# EAGLE design hvreg_feedback (EAGLE 7.2.0)
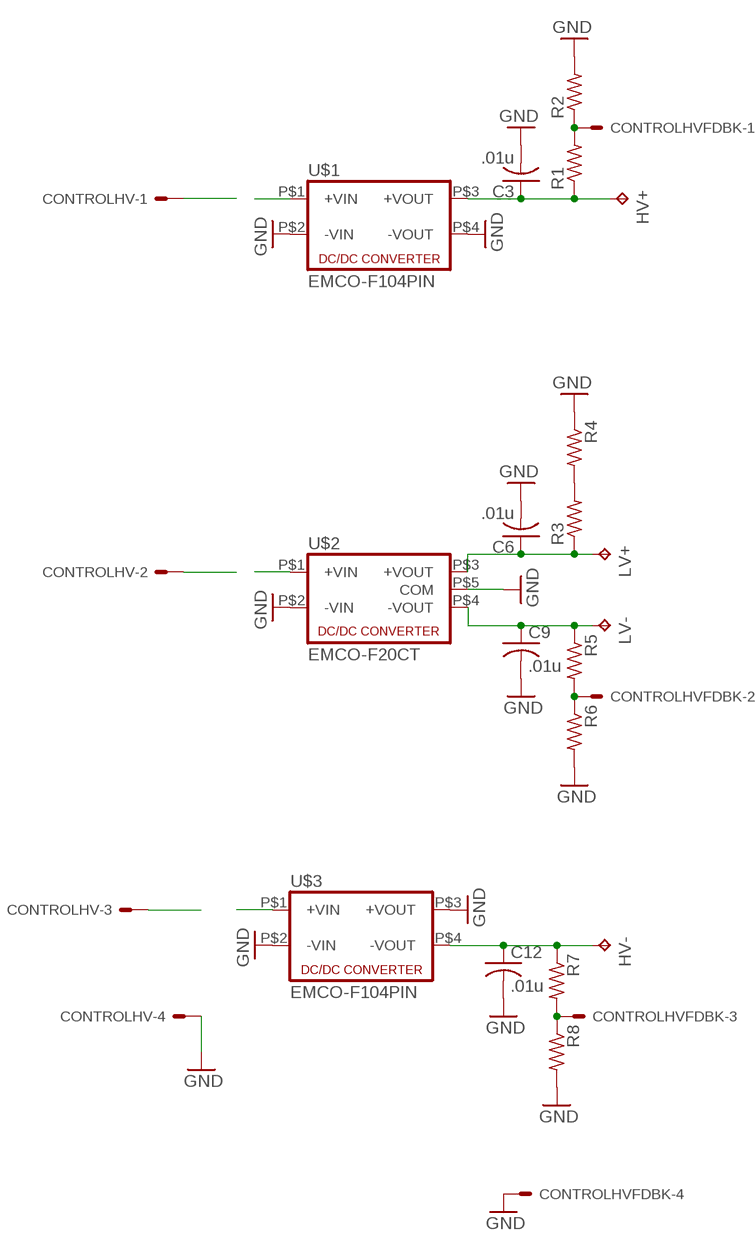
[diagram p0: schematic, sheet 1]

## Parts
C3  .01u  C-US075-042X103  [C075-042X103]
C6  .01u  C-US075-042X103  [C075-042X103]
C9  .01u  C-US075-042X103  [C075-042X103]
C12  .01u  C-US075-042X103  [C075-042X103]
CONTROLHV  KK-156-4  [KK-156-4]
CONTROLHVFDBK  KK-156-4  [KK-156-4]
HV+  TPPAD1-20Y  [P1-20Y]
HV-  TPPAD1-20Y  [P1-20Y]
LV+  TPPAD1-20Y  [P1-20Y]
LV-  TPPAD1-20Y  [P1-20Y]
R1  R-US_0207/12  [0207/12]
R2  R-US_0207/12  [0207/12]
R3  R-US_0207/12  [0207/12]
R4  R-US_0207/12  [0207/12]
R5  R-US_0207/12  [0207/12]
R6  R-US_0207/12  [0207/12]
R7  R-US_0207/12  [0207/12]
R8  R-US_0207/12  [0207/12]
U$1  EMCO-F104PIN  [EMCO-F]
U$2  EMCO-F20CT  [EMCO-F*CT]
U$3  EMCO-F104PIN  [EMCO-F]

## Nets
GND: C3.2 C6.2 C9.2 C12.2 CONTROLHV.4 CONTROLHVFDBK.4 R2.2 R4.1 R6.2 R8.2 U$1.P$2(-VIN) U$1.P$4(-VOUT) U$2.P$2(-VIN) U$2.P$5(COM) U$3.P$2(-VIN) U$3.P$3(+VOUT)
N$1: C3.1 HV+.TP R1.1 U$1.P$3(+VOUT)
N$2: C12.1 HV-.TP R7.1 U$3.P$4(-VOUT)
N$3: CONTROLHVFDBK.1 R1.2 R2.1
N$4: R3.2 R4.2
N$5: C6.1 LV+.TP R3.1 U$2.P$3(+VOUT)
N$6: C9.1 LV-.TP R5.1 U$2.P$4(-VOUT)
N$7: CONTROLHVFDBK.2 R5.2 R6.1
N$8: CONTROLHVFDBK.3 R7.2 R8.1
VREG1: CONTROLHV.1 U$1.P$1(+VIN)
VREG2: CONTROLHV.2 U$2.P$1(+VIN)
VREG3: CONTROLHV.3 U$3.P$1(+VIN)

## Library data of the parts
C3 C6 C9 C12 = rcl:C-US: CAPACITOR, American symbol
CONTROLHV CONTROLHVFDBK = con-molex:KK-156-4: KK 156 HEADER Source: http://www.molex.com/pdm_docs/sd/026604100_sd.pdf; OC_FARNELL: unknown; OC_NEWARK: unknown
HV+ HV- LV+ LV- = testpad:TP: Test pad
R1-R8 = resistor:R-US_: RESISTOR, American symbol
U$1 U$3 = dc-dc-converter:EMCO-F10
U$2 = dc-dc-converter:EMCO-F20CT

## Board
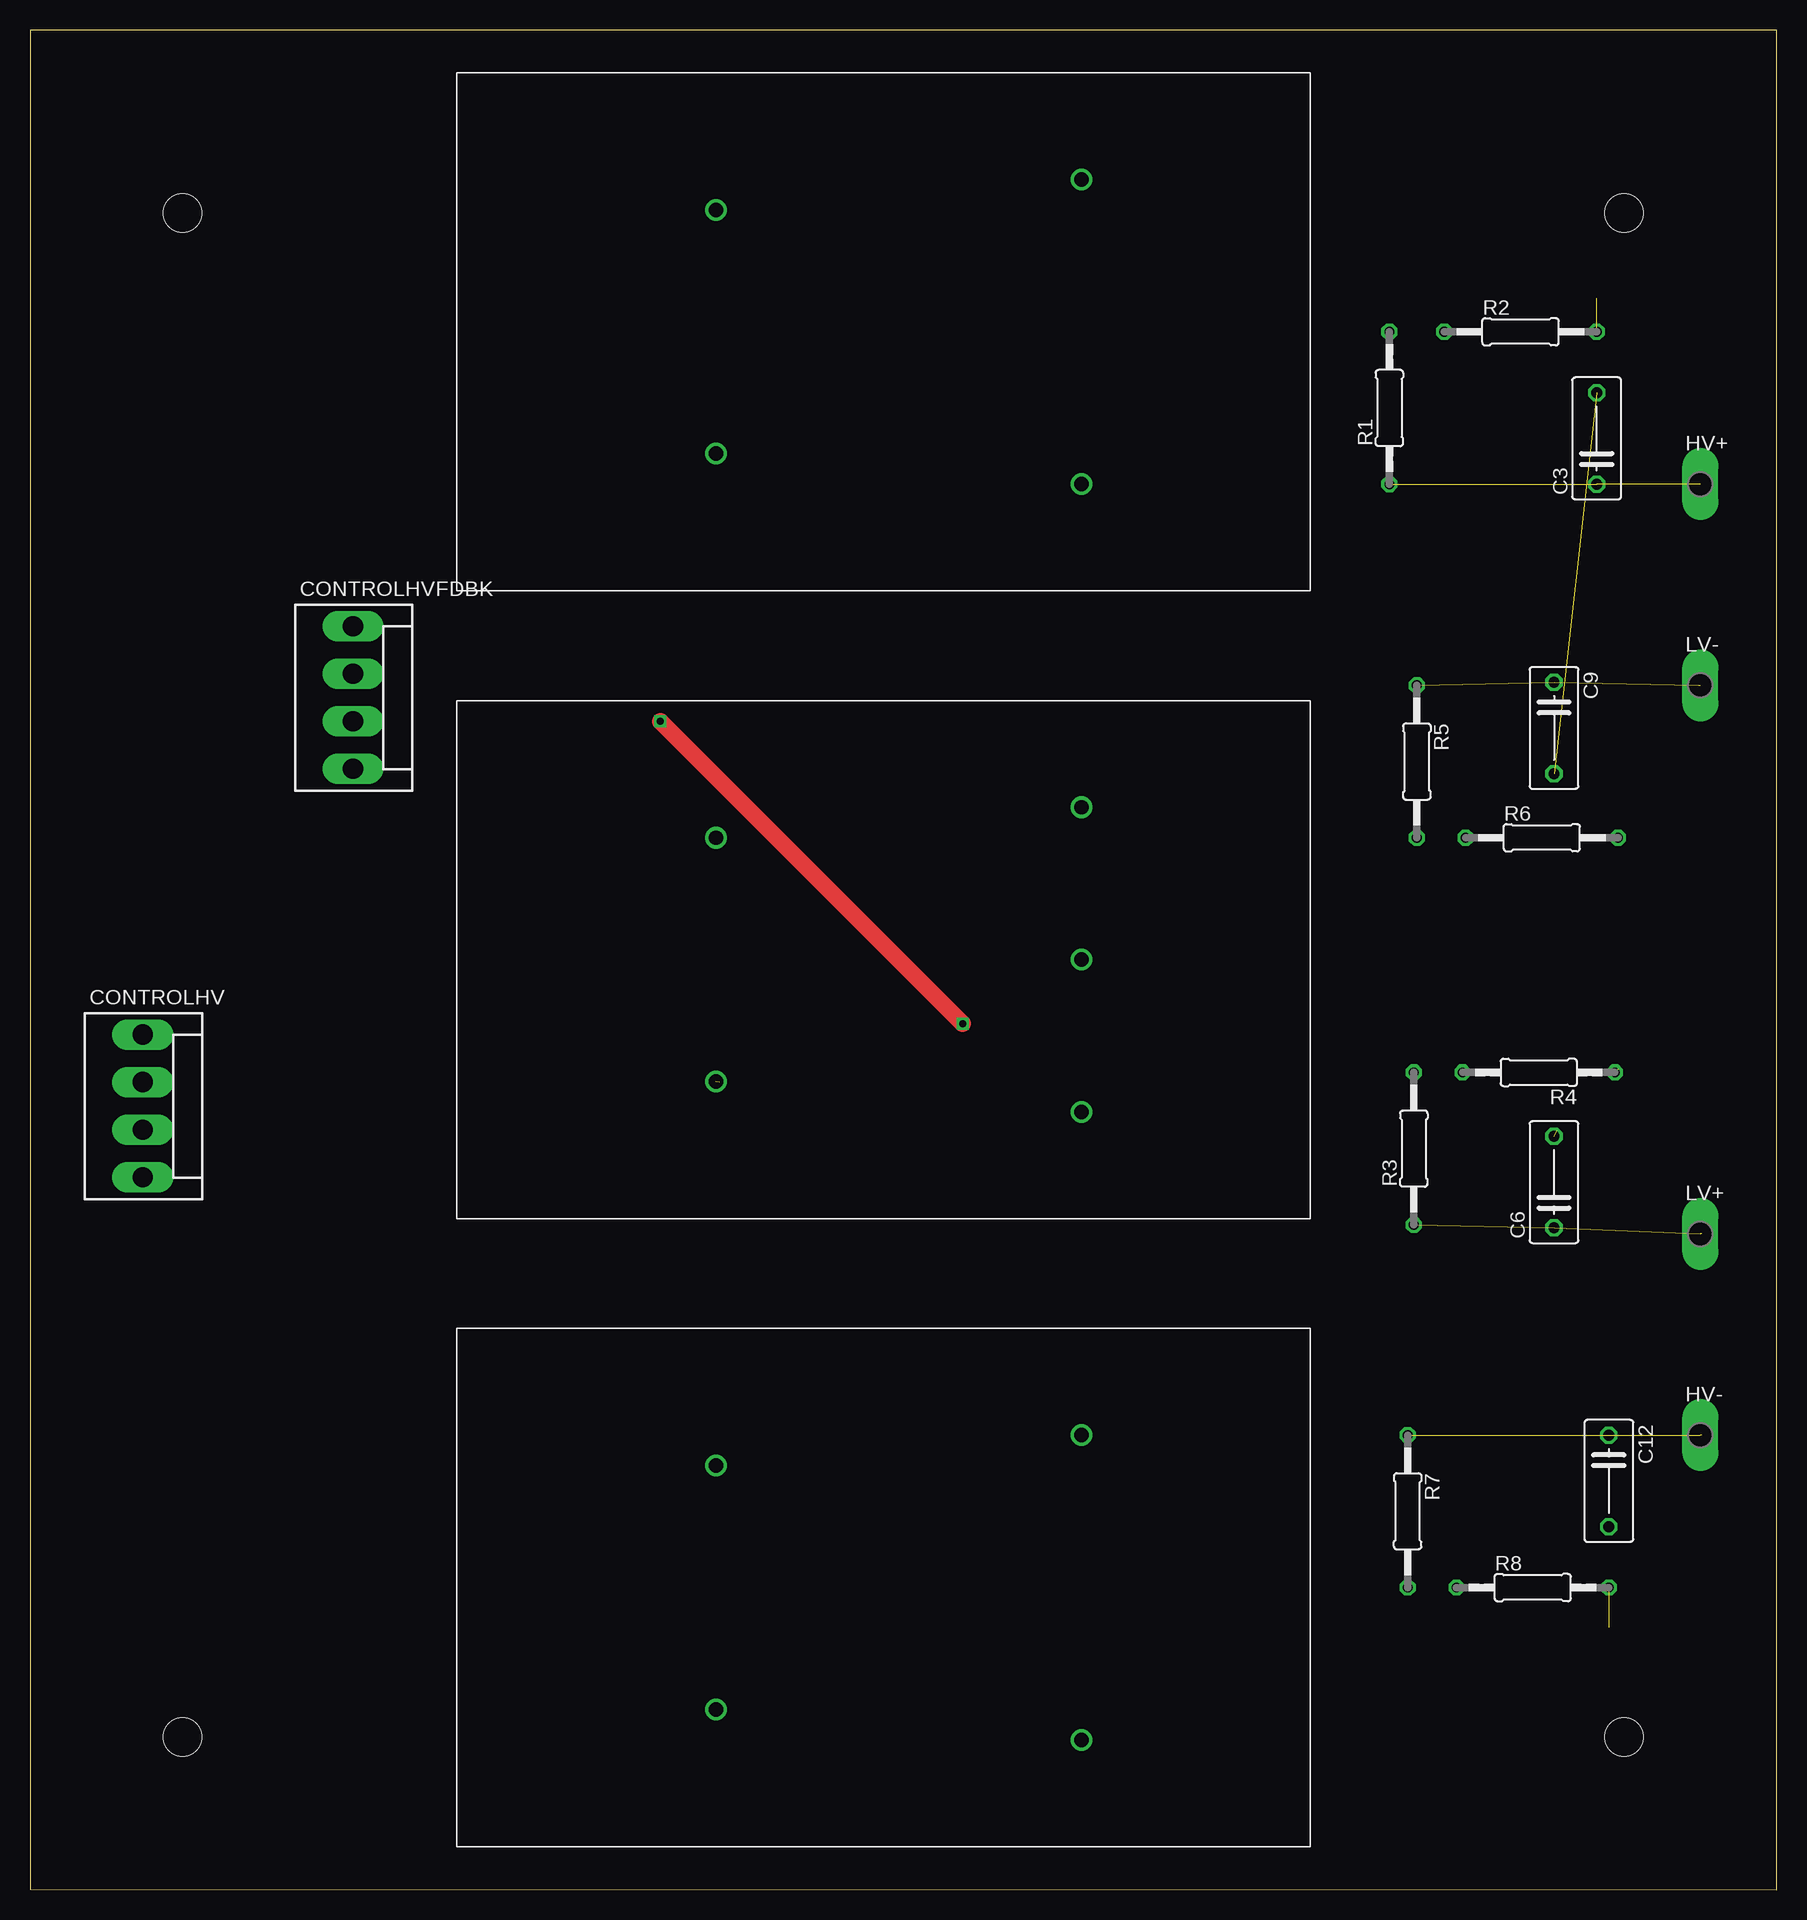
[diagram p1: board, top side]
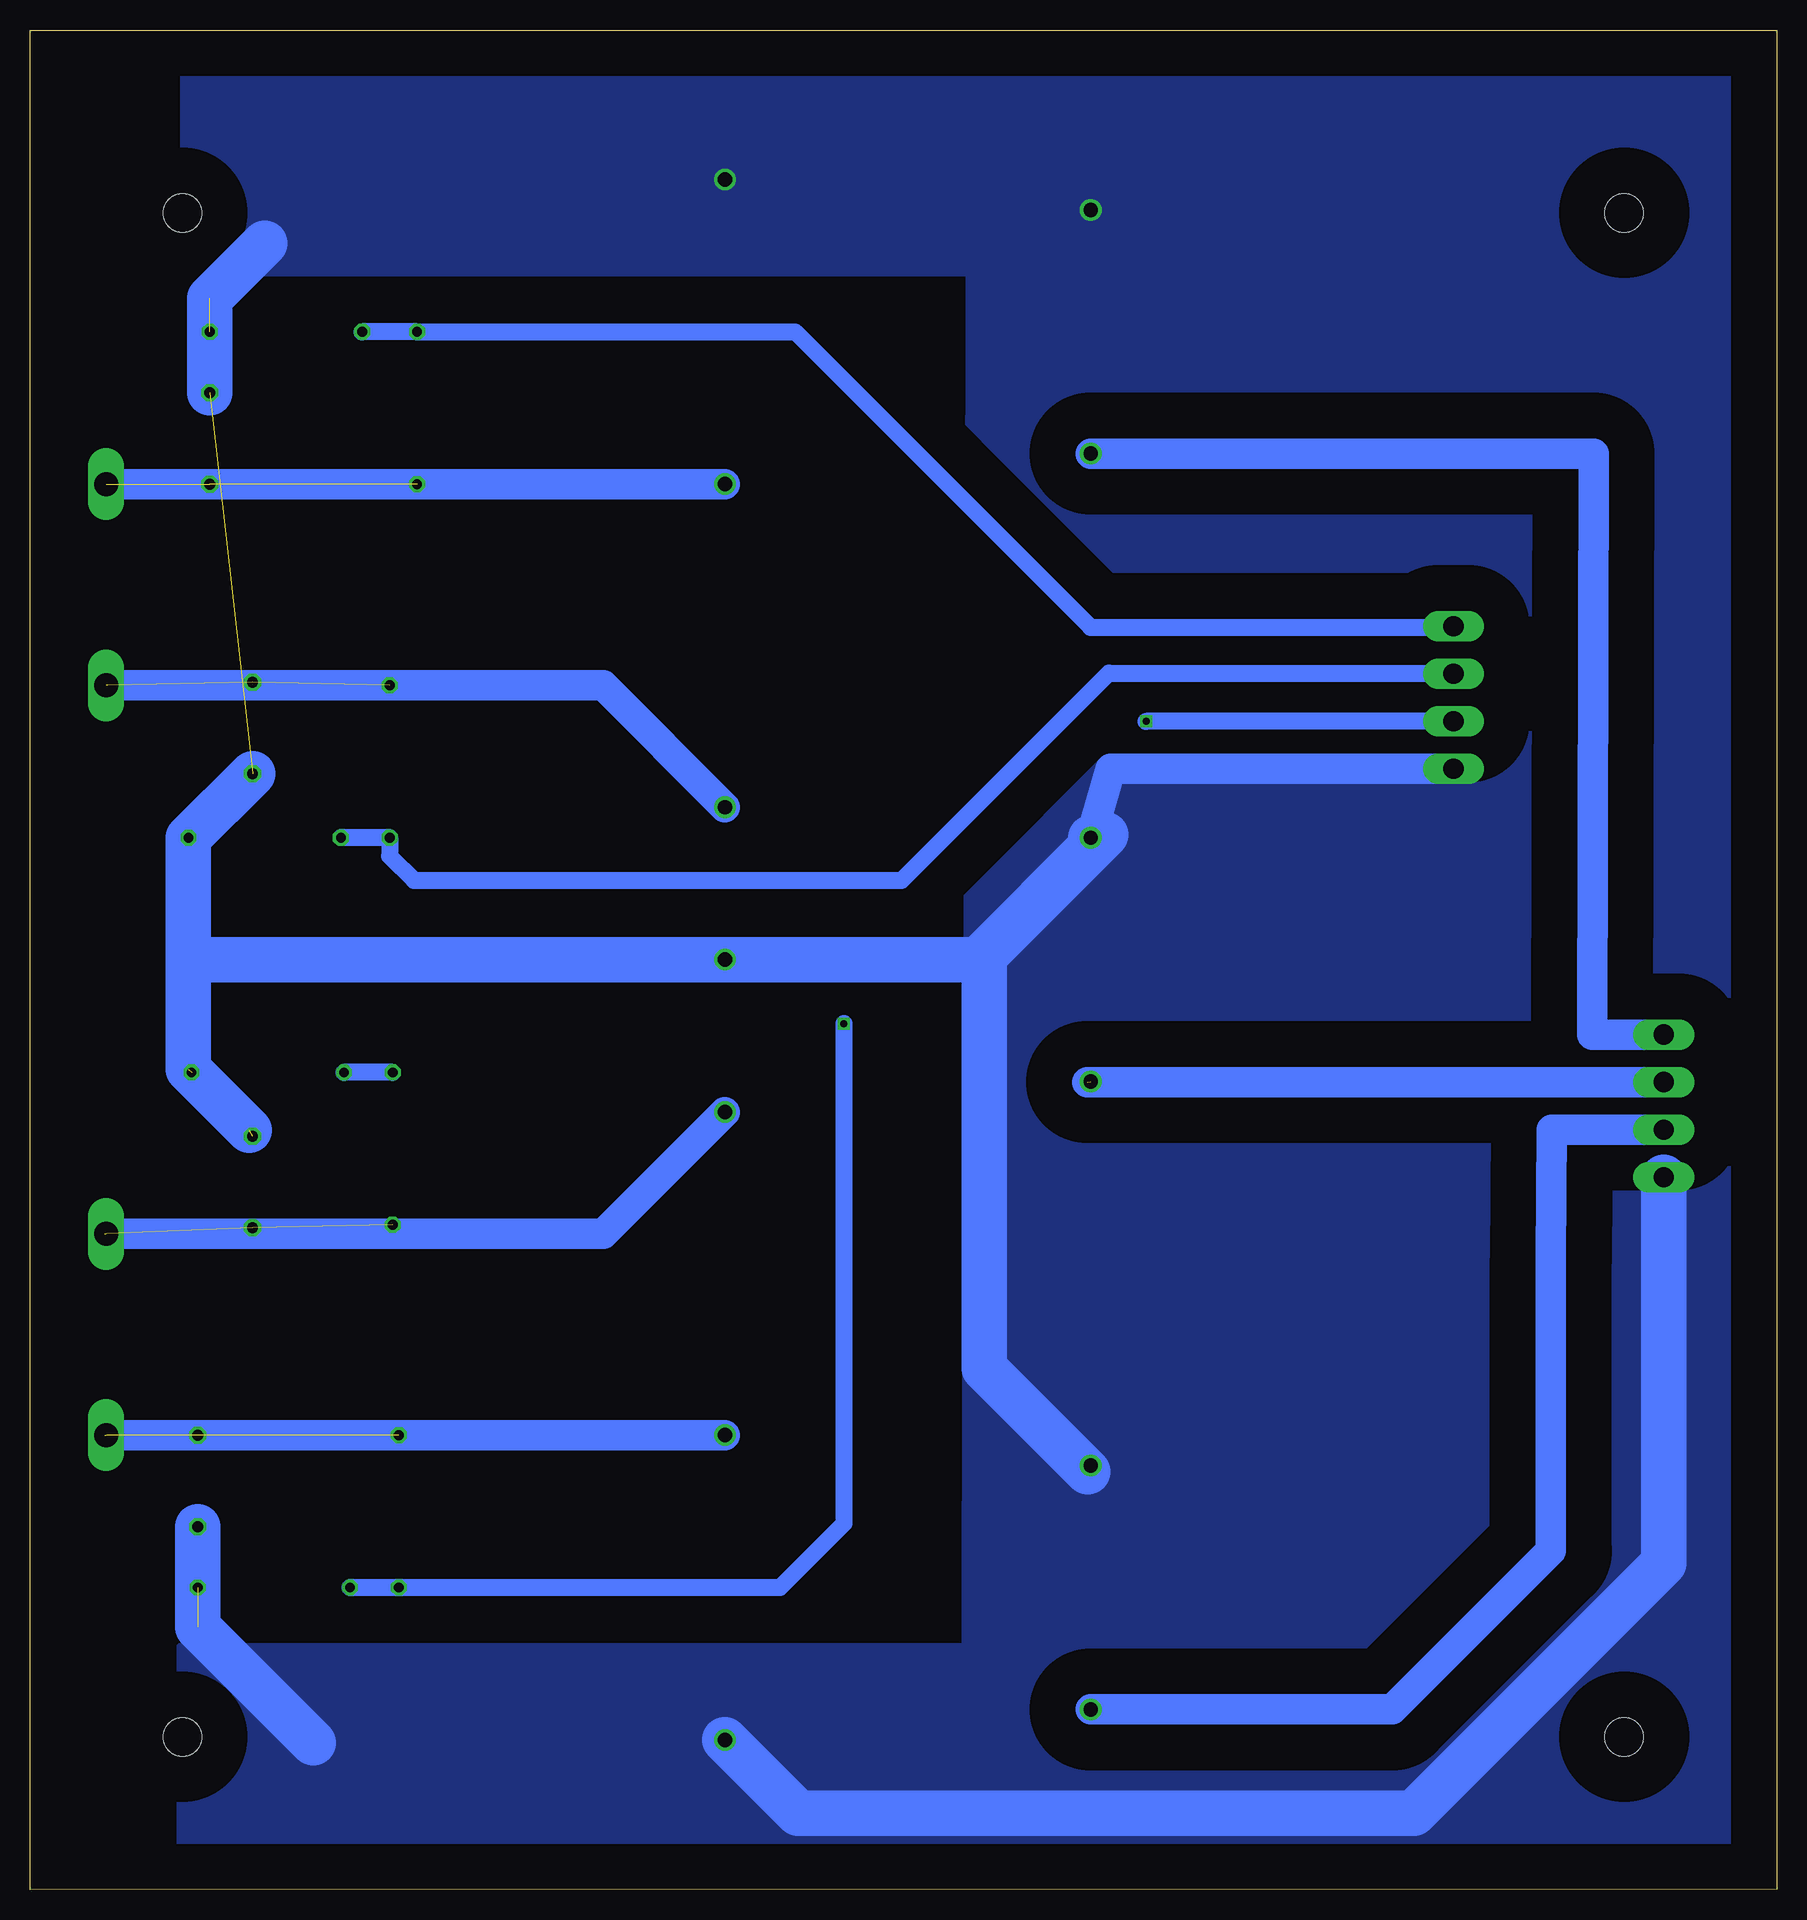
[diagram p2: board, bottom side, seen from below]

Size 145.54 x 154.96 mm. Coordinates in mm from the lower left corner, seen from the top.
Outline: 0,0.02 145.54,0 145.54,154.96 0,154.96 0,0.02
Copper layers (1*16): Top 0.035mm / dielectric 1.5mm / Bottom 0.035mm
Design rules "default": minimum track width 10mil, minimum drill 24mil, track to track 8mil, track to pad 8mil, pad to pad 8mil, via to via 8mil, smd to smd 8mil, copper to edge 40mil, drill to drill 8mil, minimum pad ring 10mil, minimum via ring 8mil, stop-mask expansion 4mil, vias tented up to drill 0mil, thermal gap 10mil
Holes 3.2 mm at 132.84,12.72 132.84,139.72 12.7,12.72 12.7,139.72

### Footprints (pad centres in the part's own frame; a part is rotated, then mirrored left to right if it is on the bottom)
C075-042X103 = drill 0.914 octagon: 1 -3.81,0; 2 3.81,0
KK-156-4 = drill 1.7 pad 2.184 long: 1 -5.94,0; 2 -1.98,0; 3 1.98,0; 4 5.94,0
P1-20Y = drill 2.007 pad 2.54 long: TP 0,0
0207/12 = drill 0.813 octagon: 1 -6.35,0; 2 6.35,0
EMCO-F = drill 1.2: P$1 0,0; P$2 0,20.32; P$3 30.48,-2.54; P$4 30.48,22.86
EMCO-F*CT = drill 1.2: P$1 0,0; P$2 0,20.32; P$3 30.48,-2.54; P$4 30.48,22.86; P$5 30.48,10.16

### Placement (x,y rotation side)
C3  130.56,120.92 90 top
C6  127,58.95 90 top
C9  127,96.79 270 top
C12  131.57,34.06 270 top
CONTROLHV  9.4,65.3 270 top
CONTROLHVFDBK  26.92,99.33 270 top
HV+  139.19,117.11 0 top
HV-  139.19,37.87 0 top
LV+  139.19,54.63 0 top
LV-  139.19,100.35 0 top
R1  113.28,123.46 90 top
R2  124.21,129.81 0 top
R3  115.32,61.74 90 top
R4  125.73,68.09 180 top
R5  115.57,94 270 top
R6  125.98,87.65 0 top
R7  114.81,31.52 270 top
R8  125.22,25.17 0 top
U$1  57.15,119.65 0 top
U$2  57.15,67.33 0 top
U$3  57.15,15.01 0 top

### Tracks (layer width: path | path; a pad name or v marks a point on that pad's centre or on a via)
GND  (5 unrouted)
  Bottom 2.54: CONTROLHVFDBK.4 55.47,93.39 U$2.P$2
  Bottom 3.81: C3.2 130.56,132.61 125.98,137.18 | C12.2 131.57,21.86 121.92,12.21 | CONTROLHV.4 9.4,27.2 30.23,6.37 81.53,6.37 U$3.P$3 | U$2.P$2 57.15,86.89 66.04,78 66.04,43.45 57.4,34.82 | C9.2 R6.2 132.33,77.24 | 132.33,77.24 132.33,68.35 127.25,63.27 | 132.33,77.24 132.08,77.49 U$2.P$5 66.29,77.49 55.88,87.9
  pour Bottom (isolate 3.81, no thermals): 0,154.96 67.31,155.21 67.82,0.02 0,0.02
  pour Bottom (isolate 3.81, no thermals): 66.55,154.96 132.84,154.96 132.84,134.64 65.79,134.64
  pour Bottom (isolate 3.81, no thermals): 133.1,20.34 66.29,20.34 66.29,0.02 133.1,0.02
N$1  (2 unrouted)
  Bottom 2.54: U$1.P$3 HV+.TP
N$2  (3 unrouted)
  Bottom 2.54: U$3.P$4 139.32,37.87
N$3
  Bottom 1.422: R2.1 R1.2 81.79,129.81 57.15,105.18 27.02,105.18 CONTROLHVFDBK.1
N$4
  Bottom 1.422: R3.2 R4.2
N$5  (3 unrouted)
  Bottom 2.54: U$2.P$3 97.79,54.63 139.32,54.63
N$6  (3 unrouted)
  Bottom 2.54: U$2.P$4 97.79,100.35 139.06,100.35
N$7
  Bottom 1.422: R6.1 R5.2 115.57,86.13 113.54,84.09 72.9,84.09 55.63,101.37 26.98,101.37 CONTROLHVFDBK.2
N$8  (via drill 0.6)
  Top 1.422: v52.53,97.35 v77.72,72.16
  Bottom 1.422: R8.1 R7.2 83.06,25.17 77.72,30.5 v77.72,72.16 | CONTROLHVFDBK.3 v52.53,97.35
VREG1
  Bottom 2.54: CONTROLHV.1 15.34,71.24 15.24,119.65 U$1.P$1
VREG2  (1 unrouted)
  Bottom 2.54: CONTROLHV.2 57.46,67.28
VREG3
  Bottom 2.54: CONTROLHV.3 18.74,63.32 18.8,52.6 18.8,28.21 32,15.01 U$3.P$1